# EAGLE design GasSensorModule_v1.0 (EAGLE 7.2.0)
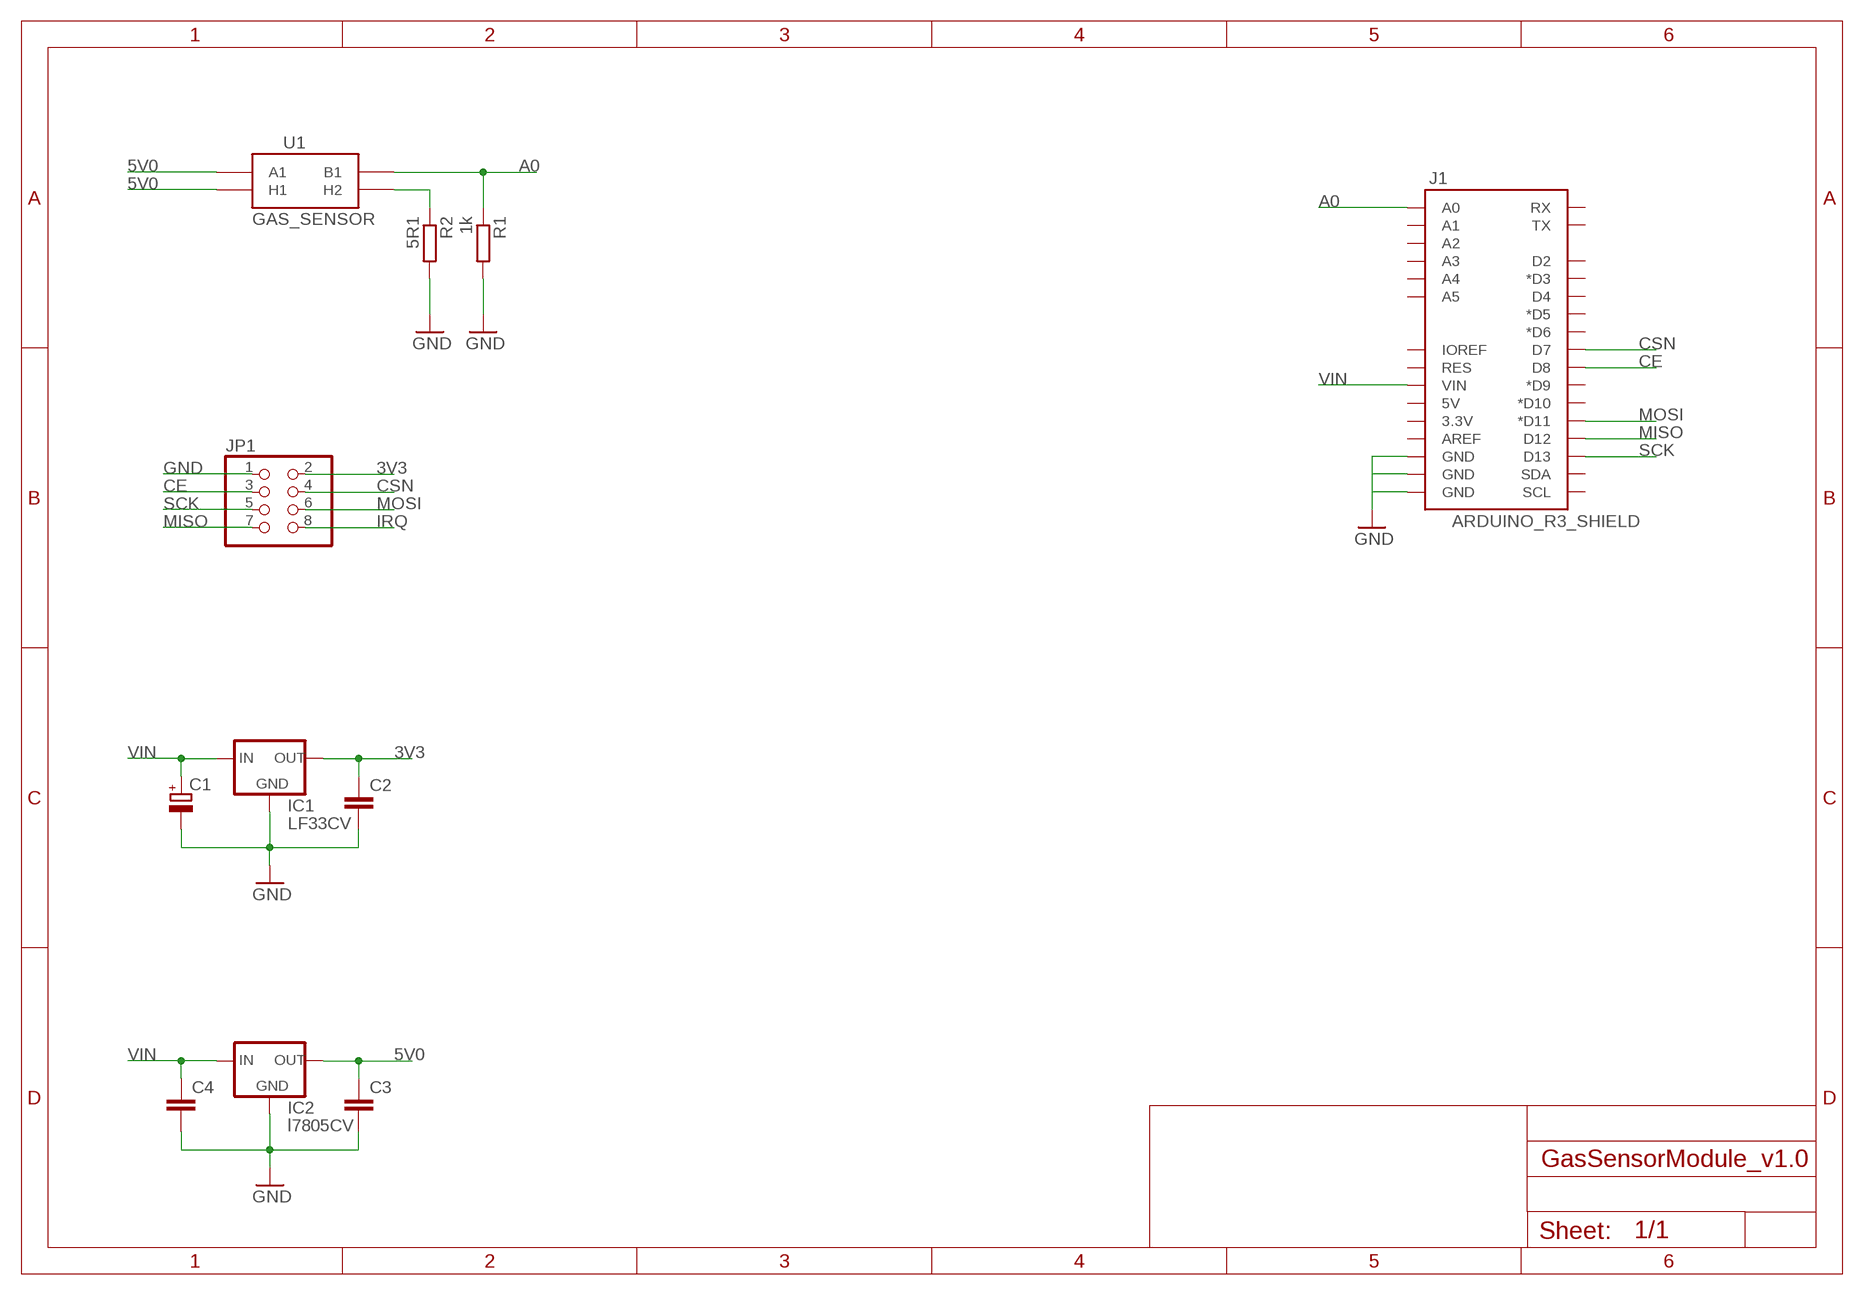
[diagram p0: schematic, sheet 1]

## Parts
C1  CPOL-EUE2,5-6E  [E2,5-6E]
C2  C-EU025-025X050  [C025-025X050]
C3  C-EU025-025X050  [C025-025X050]
C4  C-EU025-025X050  [C025-025X050]
IC1  LF33CV  78XXS  [78XXS]
IC2  l7805CV  78XXS  [78XXS]
J1  ARDUINO_R3_SHIELD  [UNO_R3_SHIELD]
JP1  PINHD-2X4  [2X04]
R1  1k  R-EU_0207/10  [0207/10]
R2  5R1  R-EU_0207/10  [0207/10]
U1  GAS_SENSOR  [MQ-3]

## Nets
3V3: C2.1 IC1.OUT JP1.2
5V0: C3.1 IC2.OUT U1.A1 U1.HA(H1)
A0: J1.A0 R1.1 U1.B1
CE: J1.D8 JP1.3
CSN: J1.D7 JP1.4
GND: C1.- C2.2 C3.2 C4.2 IC1.GND IC2.GND J1.GND@0(GND) J1.GND@1(GND) J1.GND@2(GND) JP1.1 R1.2 R2.2
IRQ: JP1.8
MISO: J1.D12 JP1.7
MOSI: J1.D11(*D11) JP1.6
N$3: R2.1 U1.HB(H2)
SCK: J1.D13 JP1.5
VIN: C1.+ C4.1 IC1.IN IC2.IN J1.VIN
Unconnected: J1.3.3V J1.5V J1.A1 J1.A2 J1.A3 J1.A4 J1.A5 J1.AREF J1.D2 J1.D3(*D3) J1.D4 J1.D5(*D5) J1.D6(*D6) J1.D9(*D9) J1.D10(*D10) J1.IOREF J1.RES J1.RX J1.SCL J1.SDA J1.TX

## Library data of the parts
C1 = rcl:CPOL-EU: POLARIZED CAPACITOR, European symbol
C2-C4 = rcl:C-EU: CAPACITOR, European symbol
IC1 IC2 = v-reg:78XXS: VOLTAGE REGULATOR
J1 = SparkFun-Boards:ARDUINO_R3_SHIELD: Shield form compatible with the Arduino Uno R3.
JP1 = pinhead:PINHD-2X4: PIN HEADER
R1 R2 = rcl:R-EU_: RESISTOR, European symbol
U1 = SparkFun-Sensors:GAS_SENSOR: MQ-3 alcohol gas sensor . FP not tested. SEN-08880.

## Board
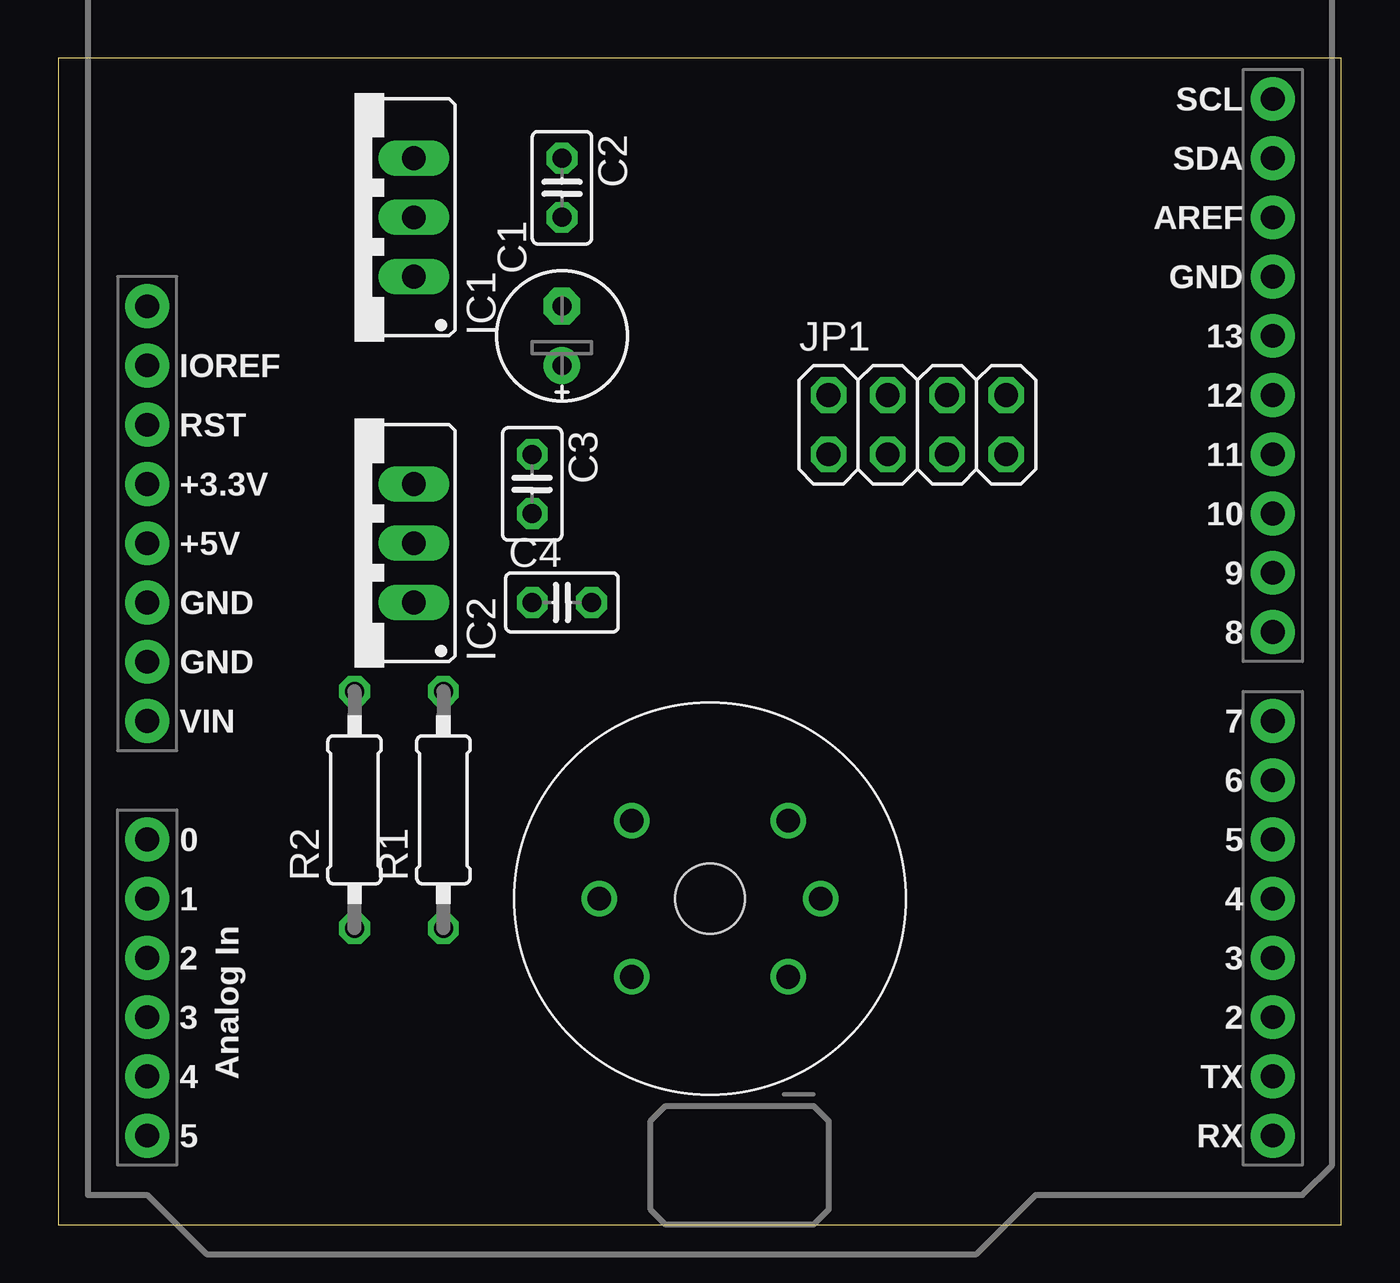
[diagram p1: board, top side]
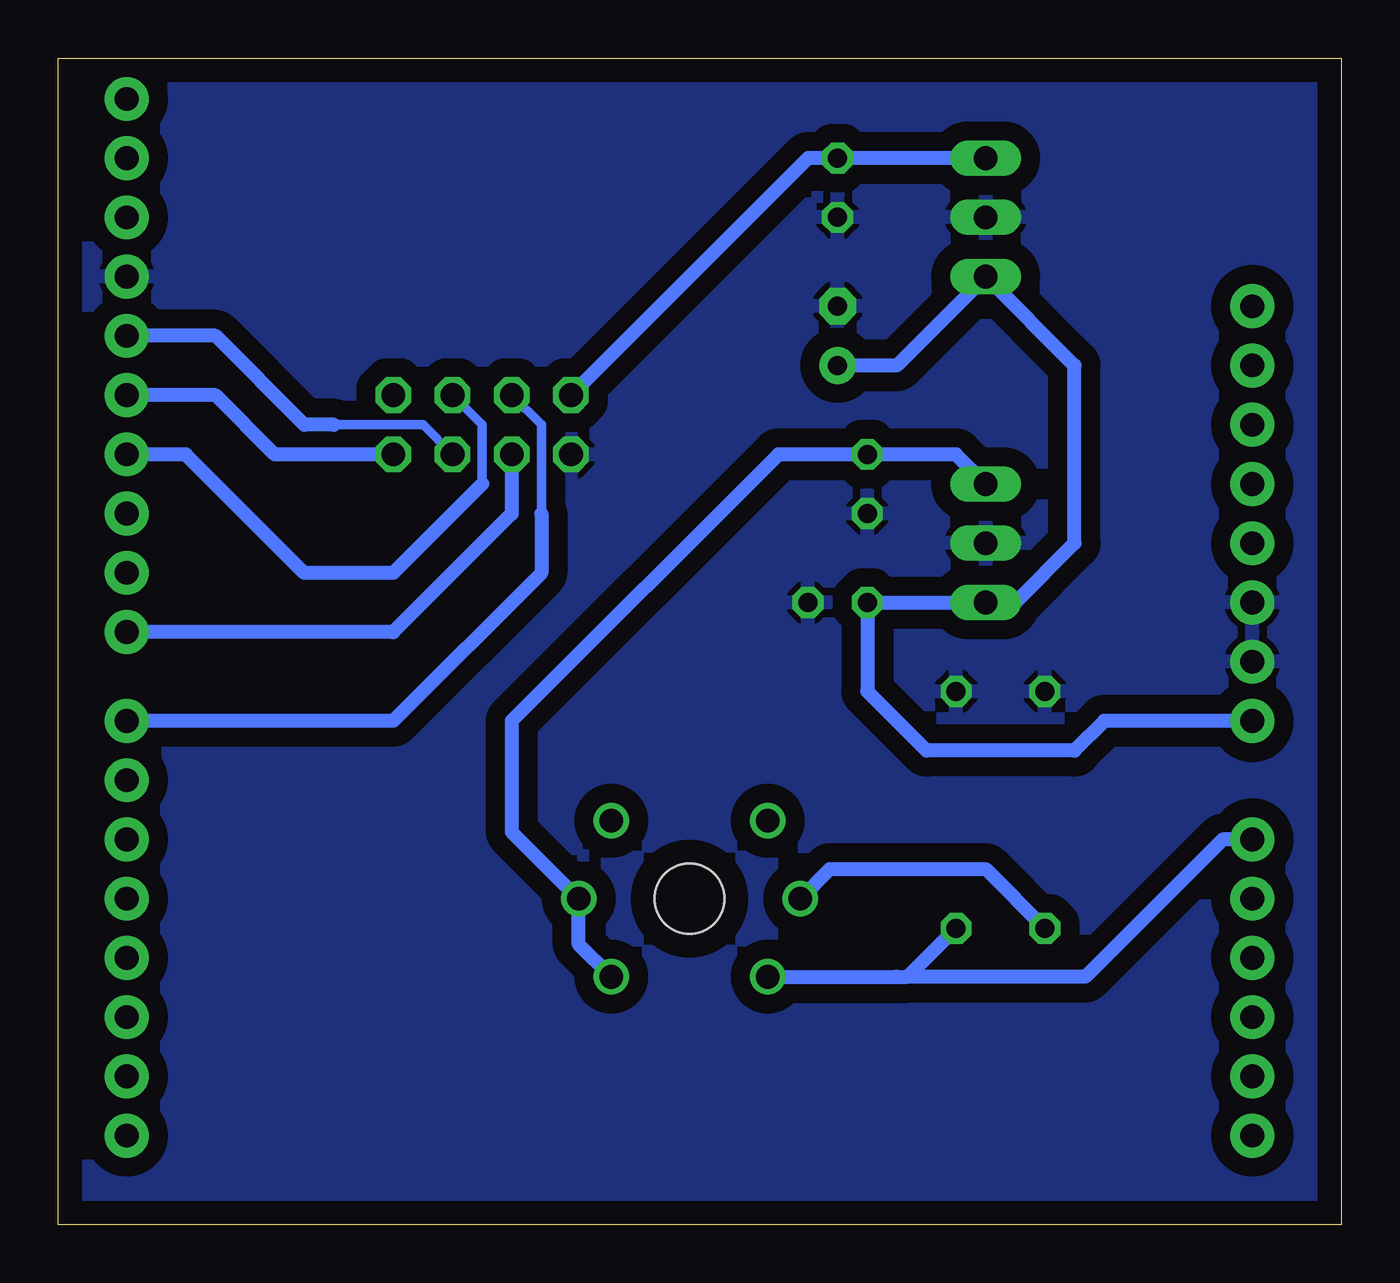
[diagram p2: board, bottom side, seen from below]

Size 55 x 50 mm. Coordinates in mm from the lower left corner, seen from the top.
Outline: 0,0 55,0 55,50 0,50 0,0
Copper layers (1*16): Top 0.035mm / dielectric 1.5mm / Bottom 0.035mm
Design rules "default": minimum track width 10mil, minimum drill 24mil, track to track 8mil, track to pad 8mil, pad to pad 8mil, via to via 8mil, smd to smd 8mil, copper to edge 40mil, drill to drill 8mil, minimum pad ring 10mil, minimum via ring 8mil, stop-mask expansion 4mil, vias tented up to drill 0mil, thermal gap 10mil

### Footprints (pad centres in the part's own frame; a part is rotated, then mirrored left to right if it is on the bottom)
E2,5-6E = drill 0.813 pad 1.575: + -1.27,0 | drill 0.813 pad 1.575 octagon: - 1.27,0
C025-025X050 = drill 0.813 octagon: 1 -1.27,0; 2 1.27,0
78XXS = drill 1.016 long: GND 0,-2.54; IN -2.54,-2.54; OUT 2.54,-2.54
UNO_R3_SHIELD = drill 1.016 pad 1.88: 3.3V 50.8,26.67; 5V 50.8,29.21; A0 50.8,41.91; A1 50.8,44.45; A2 50.8,46.99; A3 50.8,49.53; A4 50.8,52.07; A5 50.8,54.61; AREF 2.54,15.24; D2 2.54,49.53; D3 2.54,46.99; D4 2.54,44.45; D5 2.54,41.91; D6 2.54,39.37; D7 2.54,36.83; D8 2.54,33.02; D9 2.54,30.48; D10 2.54,27.94; D11 2.54,25.4; D12 2.54,22.86; D13 2.54,20.32; GND@0 50.8,31.75; GND@1 50.8,34.29; GND@2 2.54,17.78; IOREF 50.8,21.59; NC 50.8,19.05; RES 50.8,24.13; RX 2.54,54.61; SCL 2.54,10.16; SDA 2.54,12.7; TX 2.54,52.07; VIN 50.8,36.83
2X04 = drill 1.016 octagon: 1 -3.81,-1.27; 2 -3.81,1.27; 3 -1.27,-1.27; 4 -1.27,1.27; 5 1.27,-1.27; 6 1.27,1.27; 7 3.81,-1.27; 8 3.81,1.27
0207/10 = drill 0.813 octagon: 1 -5.08,0; 2 5.08,0
MQ-3 = drill 1.016: A1 -3.35,3.35; A2 -3.35,-3.35; B1 3.35,3.35; B2 3.35,-3.35; HA -4.75,0; HB 4.75,0 | hole 3: 0,0

### Placement (x,y rotation side)
C1  21.59,38.1 90 top
C2  21.59,44.45 270 top
C3  20.32,31.75 270 top
C4  21.59,26.67 0 top
IC1  12.7,43.18 90 top
IC2  12.7,29.21 90 top
J1  54.61,58.42 180 top
JP1  36.83,34.29 0 top
R1  16.51,17.78 90 top
R2  12.7,17.78 90 top
U1  27.94,13.97 180 top

### Tracks (layer width: path | path; a pad name or v marks a point on that pad's centre or on a via)
3V3
  Bottom 0.61: IC1.OUT C2.1 22.86,45.72 JP1.2
5V0
  Bottom 0.61: U1.A1 32.69,12.02 U1.HA 35.56,16.84 35.56,21.59 24.13,33.02 C3.1 16.51,33.02 IC2.OUT
A0
  Bottom 0.61: U1.B1 19.05,10.62 18.59,10.62 | 18.59,10.62 R1.1 | J1.A0 5.08,16.51 10.97,10.62 18.59,10.62
CE
  Bottom 0.61: JP1.3 35.56,30.48 40.64,25.4 J1.D8
CSN
  Bottom 0.406: JP1.4 34.29,34.29 34.29,30.48
  Bottom 0.61: 34.29,30.48 34.29,27.94 40.64,21.59 J1.D7
GND
  pour Bottom (isolate 0.813): 0,49.53 54.61,49.53 54.61,0 0,0
MISO
  Bottom 0.61: JP1.7 45.72,33.02 48.26,35.56 J1.D12
MOSI
  Bottom 0.406: JP1.6 36.83,34.29 36.83,31.75
  Bottom 0.61: 36.83,31.75 40.64,27.94 44.45,27.94 49.53,33.02 J1.D11
N$3
  Bottom 0.61: U1.HB 21.92,15.24 15.24,15.24 R2.1
SCK
  Bottom 0.406: JP1.5 39.37,34.29 43.18,34.29
  Bottom 0.61: 43.18,34.29 44.45,34.29 48.26,38.1 J1.D13
VIN
  Bottom 0.61: J1.VIN 10.16,21.59 11.43,20.32 17.78,20.32 20.32,22.86 C4.1 IC2.IN 13.97,26.67 11.43,29.21 11.43,36.83 IC1.IN 19.05,36.83 C1.+